# EAGLE design PCB (EAGLE 7.5.0)
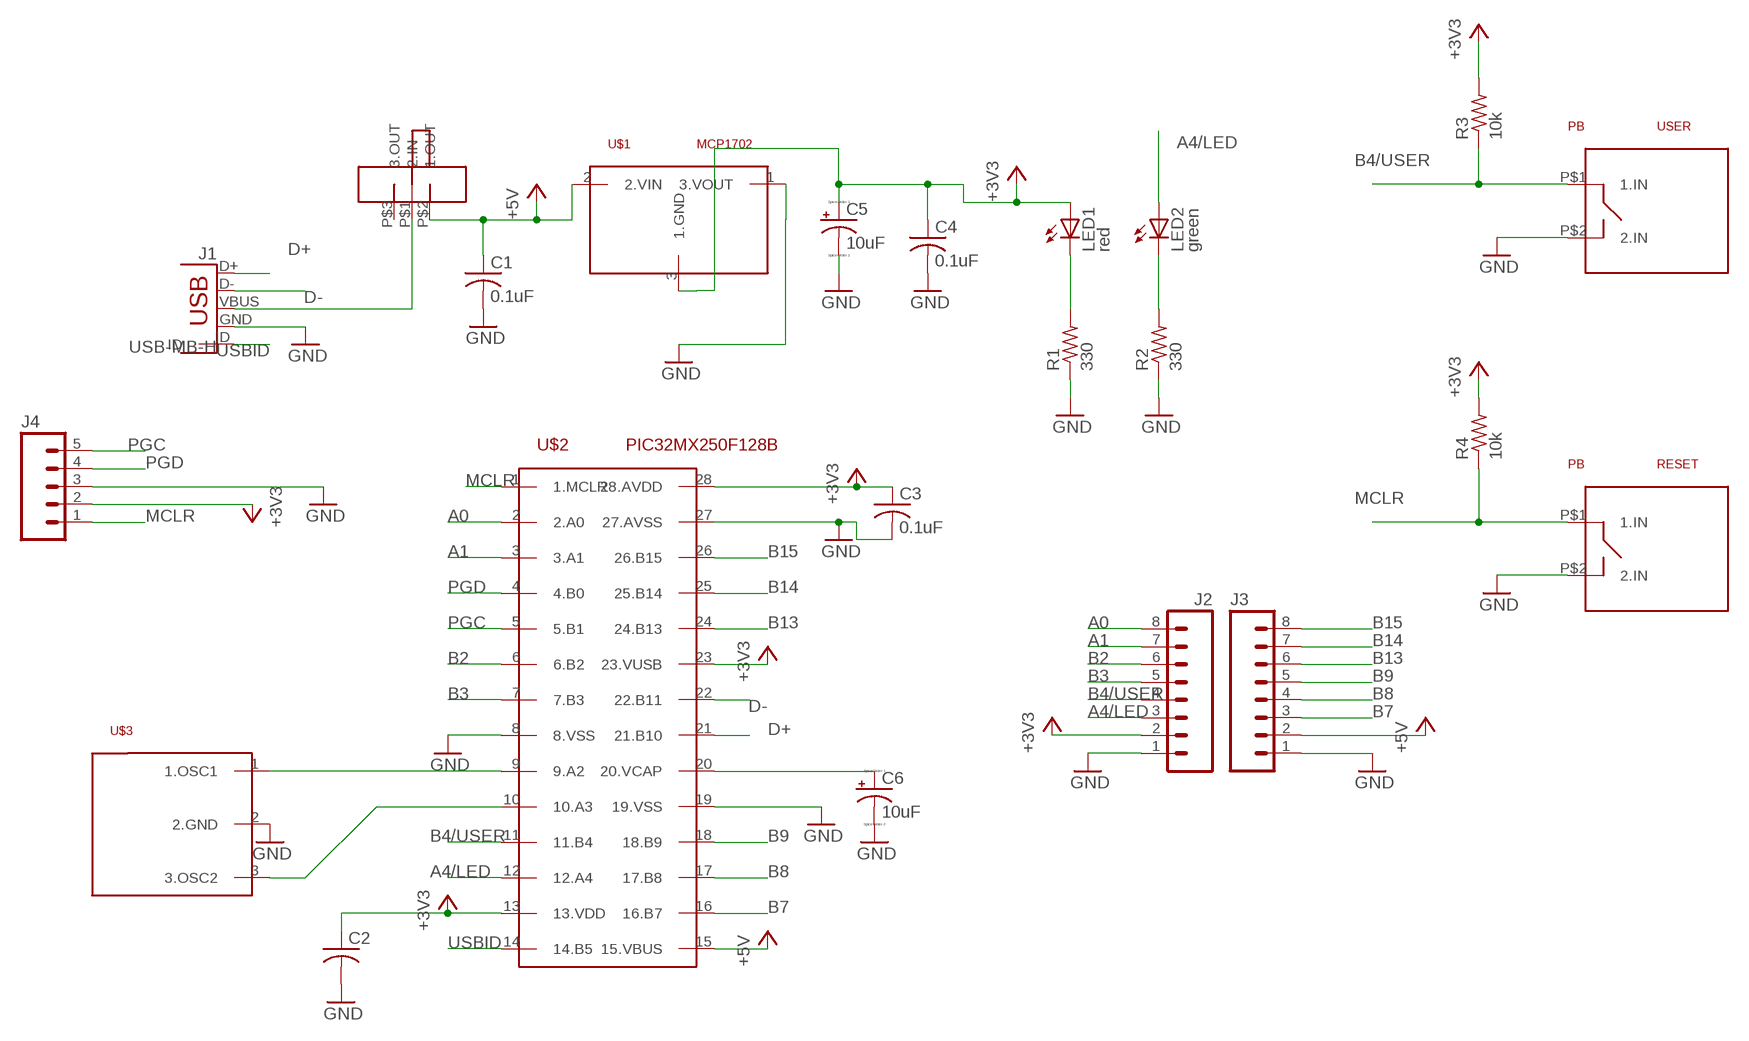
[diagram p0: schematic, sheet 1]

## Parts
C1  0.1uF  C-US025-025X050  [C025-025X050]
C2  C-US025-025X050  [C025-025X050]
C3  0.1uF  C-US025-025X050  [C025-025X050]
C4  0.1uF  C-US025-025X050  [C025-025X050]
C5  10uF  CPOL-USB45181A  [B45181A]
C6  10uF  CPOL-USB45181A  [B45181A]
J1  USB-MB-H  [USB-MB-H]
J2  M08  [1X08_ROUND]
J3  M08  [1X08_ROUND]
J4  M05PTH  [1X05]
LED1  red  LED3MM  [LED3MM]
LED2  green  LED3MM  [LED3MM]
R1  330  R-US_0207/10  [0207/10]
R2  330  R-US_0207/10  [0207/10]
R3  10k  R-US_0207/10  [0207/10]
R4  10k  R-US_0207/10  [0207/10]
RESET  PB  [PUSHBUTTON]
U$1  MCP1702  [TO92]
U$2  PIC32MX250F128B  [DIL28-3]
U$3  CRES  [1X03]
U$5  SLIDE  [SLIDE]
USER  PB  [PUSHBUTTON]

## Nets
+3V3: C2.1 C3.1 C4.1 C5.+ J2.2 J4.2 LED1.A R3.2 R4.2 U$1.3(1.GND) U$2.13(13.VDD) U$2.23(23.VUSB) U$2.28(28.AVDD)
+5V: C1.1 J3.2 U$1.2(2.VIN) U$2.15(15.VBUS) U$5.P$2(1.OUT)
A0: J2.8 U$2.2(2.A0)
A1: J2.7 U$2.3(3.A1)
A4/LED: J2.3 LED2.A U$2.12(12.A4)
B2: J2.6 U$2.6(6.B2)
B3: J2.5 U$2.7(7.B3)
B4/USER: J2.4 R3.1 U$2.11(11.B4) USER.P$1(1.IN)
B7: J3.3 U$2.16(16.B7)
B8: J3.4 U$2.17(17.B8)
B9: J3.5 U$2.18(18.B9)
B13: J3.6 U$2.24(24.B13)
B14: J3.7 U$2.25(25.B14)
B15: J3.8 U$2.26(26.B15)
D+: J1.D+ U$2.21(21.B10)
D-: J1.D- U$2.22(22.B11)
GND: C1.2 C2.2 C3.2 C4.2 C5.- C6.- J1.GND J2.1 J3.1 J4.3 R1.1 R2.1 RESET.P$2(2.IN) U$1.1(3.VOUT) U$2.8(8.VSS) U$2.19(19.VSS) U$2.27(27.AVSS) U$3.2(2.GND) USER.P$2(2.IN)
MCLR: J4.1 R4.1 RESET.P$1(1.IN) U$2.1(1.MCLR)
N$1: J1.VBUS U$5.P$1(2.IN)
N$5: LED2.K(C) R2.2
N$8: LED1.K(C) R1.2
N$29: C6.+ U$2.20(20.VCAP)
N$36: U$2.10(10.A3) U$3.3(3.OSC2)
N$37: U$2.9(9.A2) U$3.1(1.OSC1)
PGC: J4.5 U$2.5(5.B1)
PGD: J4.4 U$2.4(4.B0)
USBID: J1.ID U$2.14(14.B5)
Unconnected: U$5.P$3(3.OUT)

## Library data of the parts
C1-C4 = ME 433 PCB lib:C-US: CAPACITOR, American symbol
C5 C6 = ME 433 PCB lib:CPOL-US: POLARIZED CAPACITOR, American symbol
J1 = ME 433 PCB lib:USB: USB Connectors USB-B-PTH is fully proven SKU : PRT-00139/CONN-08278 USB-miniB is fully proven SKU : PRT-00587 USB-A-PCB is untested. USB-A-H is throughly reviewed, but untested. Spark Fun Electronics SKU : PRT-00437 USB-B-SMT is throughly reviewed, but untested. Needs silkscreen touching up. USB-A-S has not been used/tested USB-MB-H has not been used/tested USB-MICROB has been used. CONN-09505
J2 J3 = ME 433 PCB lib:M08: Header 8 Standard 8-pin 0.1" header. Use with straight break away headers (SKU : PRT-00116), right angle break away headers (PRT-00553), swiss pins (PRT-00743), machine pins (PRT-00117), and female headers (PRT-00115).; PROD_ID: CONN-08437
J4 = ME 433 PCB lib:M05: Header 5 Standard 5-pin 0.1" header. Use with straight break away headers (SKU : PRT-00116), right angle break away headers (PRT-00553), swiss pins (PRT-00743), machine pins (PRT-00117), and female headers (PRT-00115). Molex polarized connector foot print use with SKU : PRT-08230 with associated crimp pins and housings.
LED1 LED2 = ME 433 PCB lib:LED: LED OSRAM: - CHIPLED LG R971, LG N971, LY N971, LG Q971, LY Q971, LO R971, LY R971 LH N974, LH R974 LS Q976, LO Q976, LY Q976 LO Q996 - Hyper CHIPLED LW Q18S LB Q993, LB Q99A, LB R99A - SideLED LS A670, LO A670, LY A670, LG A670, LP A670 LB A673, LV A673, LT A673, LW A673 LH A674 LY A675 LS A676, LA A676, LO A676, LY A676, LW A676 LS A679, LY A679, LG A679 - Hyper Micro SIDELED® LS Y876, LA Y876, LO Y876, LY Y876 LT Y87S - SmartLED LW L88C, LW L88S LB L89C, LB L89S, LG L890 LS L89K, LO L89K, LY L89K LS L896, LA L896, LO L896, LY L896 - TOPLED LS T670, LO T670, LY T670, LG T670, LP T670 LSG T670, LSP T670, LSY T670, LOP T670, LYG T670 LG T671, LOG T671, LSG T671 LB T673, LV T673, LT T673, LW T673 LH T674 LS T676, LA T676, LO T676, LY T676, LB T676, LH T676, LSB T676, LW T676 LB T67C, LV T67C, LT T67C, LS T67K, LO T67K, LY T67K, LW E67C LS E67B, LA E67B, LO E67B, LY E67B, LB E67C, LV E67C, LT E67C LW T67C LS T679, LY T679, LG T679 LS T770, LO T770, LY T770, LG T770, LP T770 LB T773, LV T773, LT T773, LW T773 LH T774 LS E675, LA E675, LY E675, LS T675 LS T776, LA T776, LO T776, LY T776, LB T776 LHGB T686 LT T68C, LB T68C - Hyper Mini TOPLED® LB M676 - Mini TOPLED Santana® LG M470 LS M47K, LO M47K, LY M47K Source: http://www.osram.convergy.de LUXEON: - LUMILED® LXK2-PW12-R00, LXK2-PW12-S00, LXK2-PW14-U00, LXK2-PW14-V00 LXK2-PM12-R00, LXK2-PM12-S00, LXK2-PM14-U00 LXK2-PE12-Q00, LXK2-PE12-R00, LXK2-PE12-S00, LXK2-PE14-T00, LXK2-PE14-U00 LXK2-PB12-K00, LXK2-PB12-L00, LXK2-PB12-M00, LXK2-PB14-N00, LXK2-PB14-P00, LXK2-PB14-Q00 LXK2-PR12-L00, LXK2-PR12-M00, LXK2-PR14-Q00, LXK2-PR14-R00 LXK2-PD12-Q00, LXK2-PD12-R00, LXK2-PD12-S00 LXK2-PH12-R00, LXK2-PH12-S00 LXK2-PL12-P00, LXK2-PL12-Q00, LXK2-PL12-R00 Source: www.luxeon.com KINGBRIGHT: KA-3528ASYC Source: www.kingbright.com
R1-R4 = ME 433 PCB lib:R-US_: RESISTOR, American symbol
RESET USER = ME 433 PCB lib:PB
U$1 = ME 433 PCB lib:MCP1702
U$2 = ME 433 PCB lib:PIC32MX250F128B
U$3 = ME 433 PCB lib:CRES
U$5 = ME 433 PCB lib:SLIDE

## Board
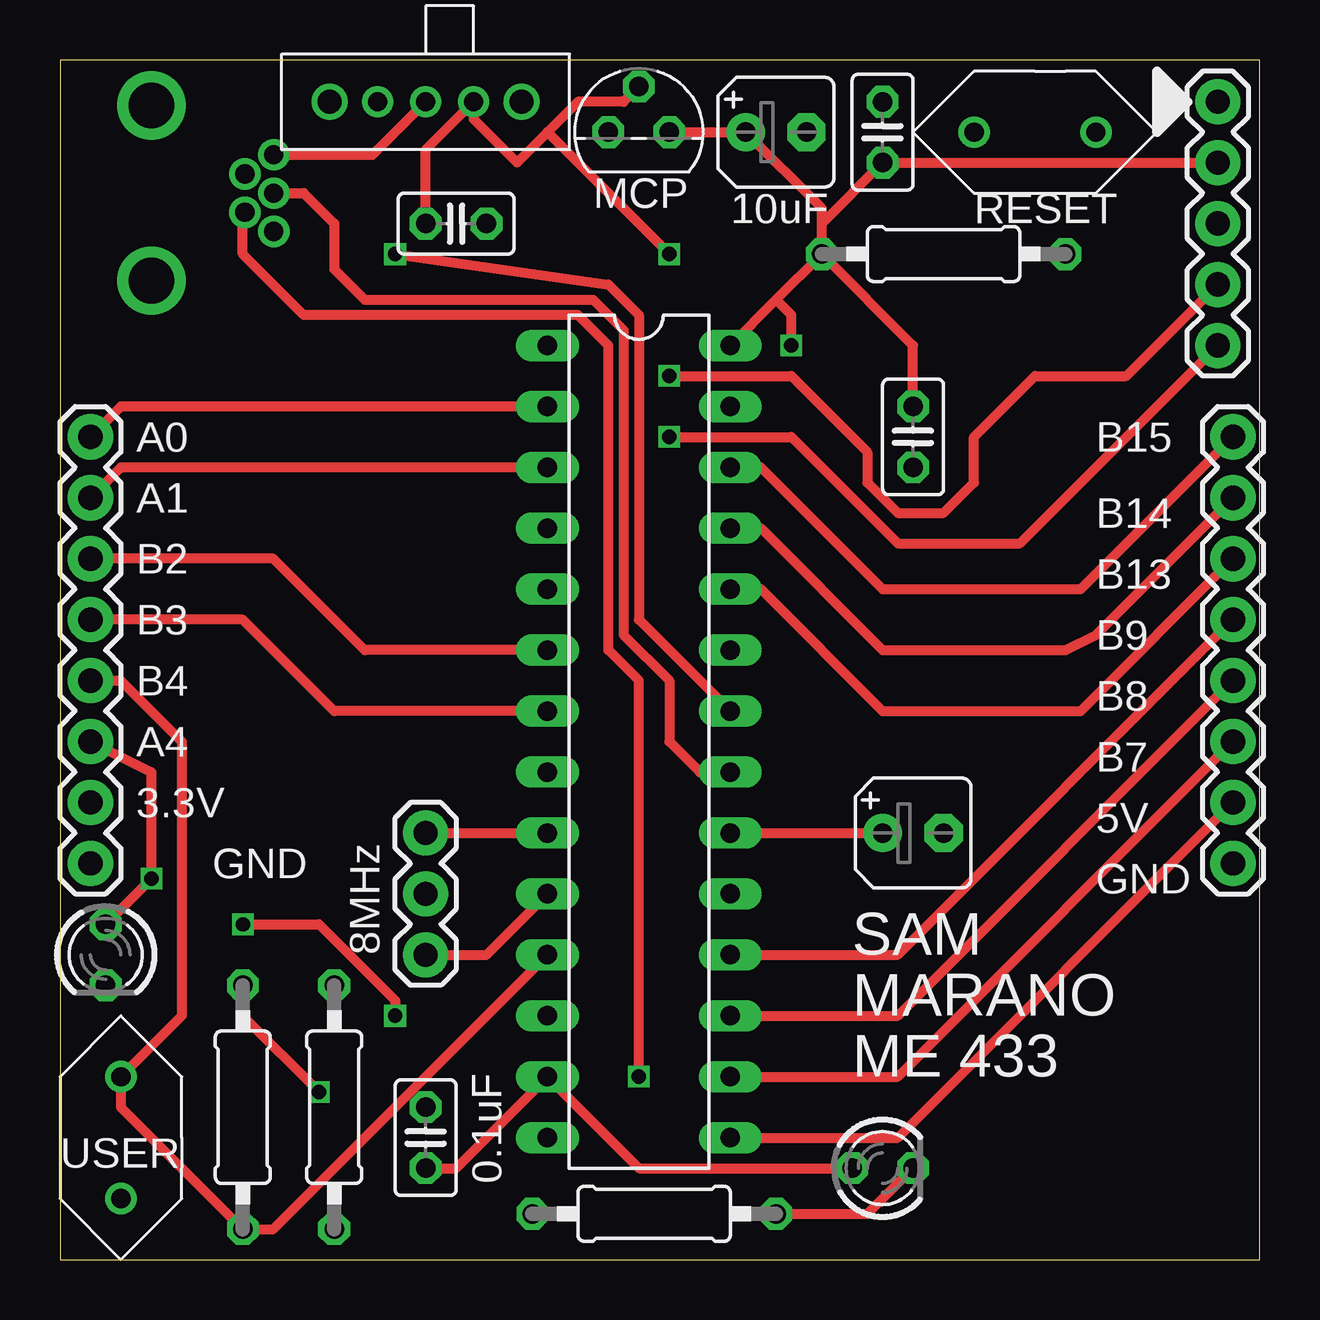
[diagram p1: board, top side]
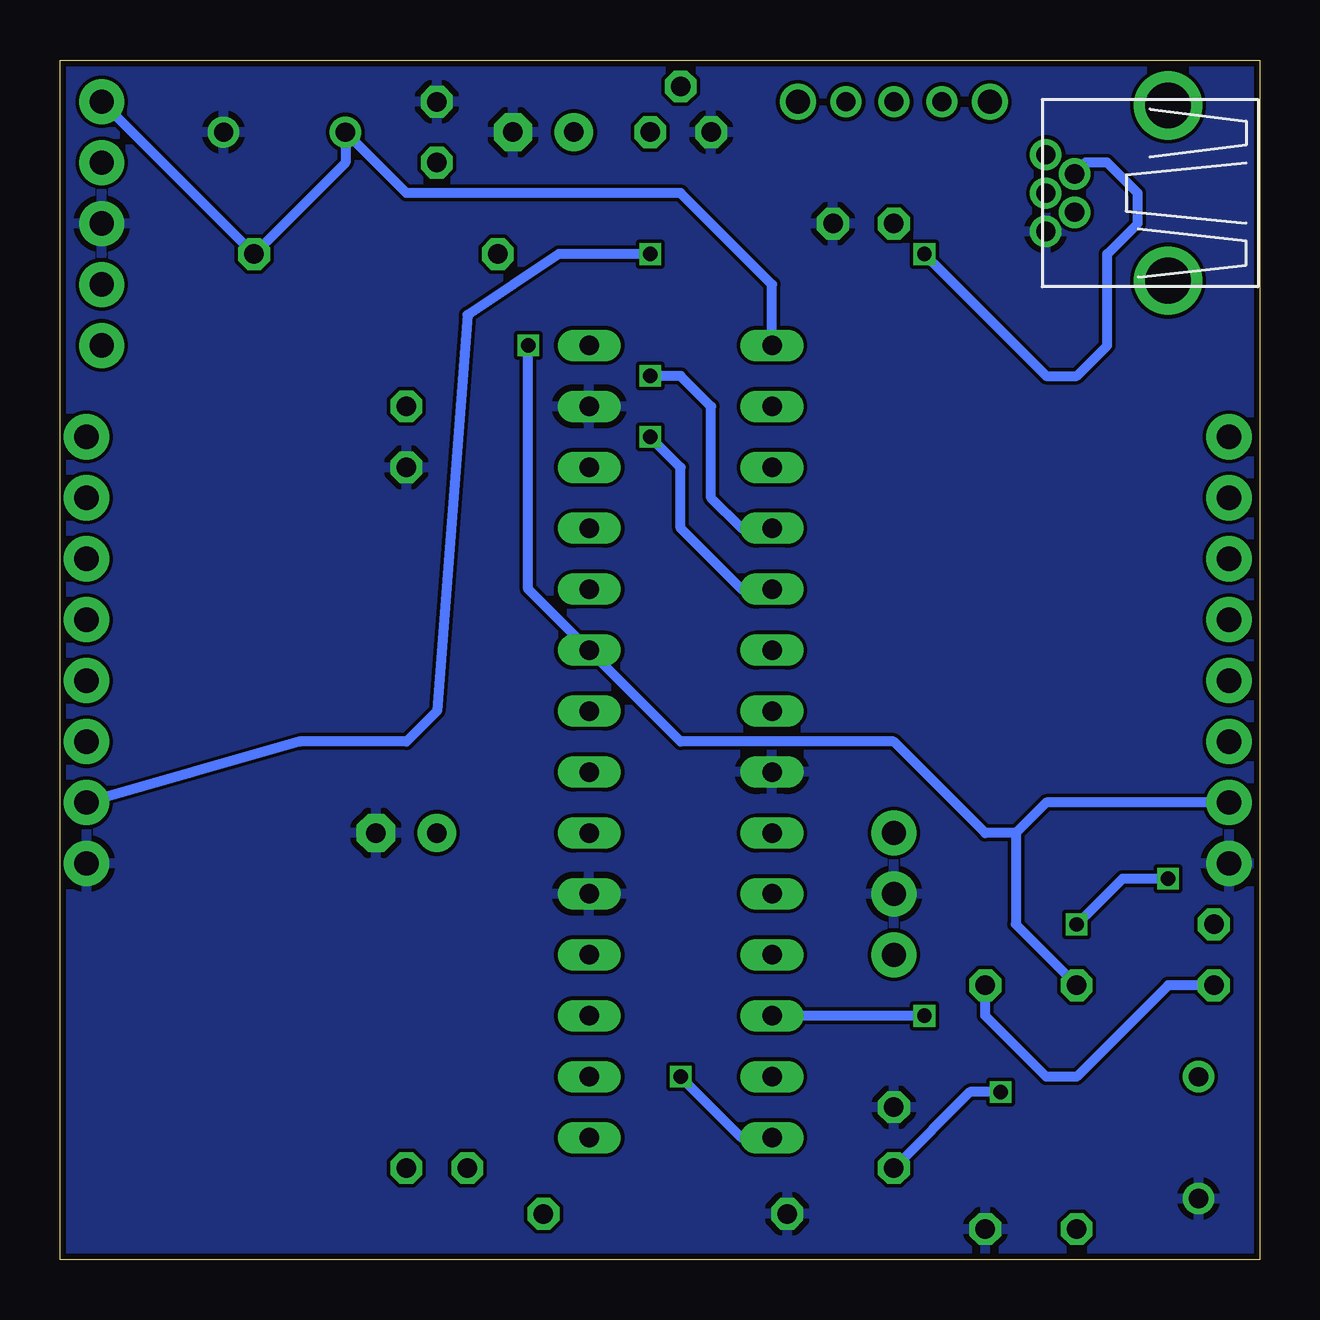
[diagram p2: board, bottom side, seen from below]

Size 50 x 50 mm. Coordinates in mm from the lower left corner, seen from the top.
Outline: 0,0 50,0 50,50 0,50 0,0
Copper layers (1*16): Top 0.035mm / dielectric 1.5mm / Bottom 0.035mm
Design rules "SeeedStudio_2layer_DRU_no_angle_20140221": minimum track width 6mil, minimum drill 12mil, track to track 6mil, track to pad 6mil, pad to pad 6mil, via to via 6mil, smd to smd 0mil, copper to edge 10mil, drill to drill 10mil, minimum pad ring 10mil, minimum via ring 6mil, stop-mask expansion 2mil, vias tented up to drill 100mil, thermal gap 10mil

### Footprints (pad centres in the part's own frame; a part is rotated, then mirrored left to right if it is on the bottom)
C025-025X050 = drill 0.813 octagon: 1 -1.27,0; 2 1.27,0
B45181A = drill 0.813 pad 1.6: + -1.27,0 | drill 0.813 pad 1.6 octagon: - 1.27,0
USB-MB-H = drill 0.8: D+ 5.1,0; D- 3.9,0.8; GND 5.1,-1.6; ID 3.9,-0.8; VBUS 5.1,1.6 | drill 1.9: P$6 0,-3.65; P$7 0,3.65
1X08_ROUND = drill 1.016 pad 1.88: 1 0,0; 2 2.54,0; 3 5.08,0; 4 7.62,0; 5 10.16,0; 6 12.7,0; 7 15.24,0; 8 17.78,0
1X05 = drill 1.016 pad 1.88: 1 0,0; 2 2.54,0; 3 5.08,0; 4 7.62,0; 5 10.16,0
LED3MM = drill 0.813 octagon: A -1.27,0; K 1.27,0
0207/10 = drill 0.813 octagon: 1 -5.08,0; 2 5.08,0
PUSHBUTTON = drill 0.8: P$1 -2.54,0; P$2 2.54,0
TO92 = drill 0.813 octagon: 1 -1.27,0; 2 0,1.905; 3 1.27,0
DIL28-3 = drill 0.813 long: 1 -16.51,-3.81; 2 -13.97,-3.81; 3 -11.43,-3.81; 4 -8.89,-3.81; 5 -6.35,-3.81; 6 -3.81,-3.81; 7 -1.27,-3.81; 8 1.27,-3.81; 9 3.81,-3.81; 10 6.35,-3.81; 11 8.89,-3.81; 12 11.43,-3.81; 13 13.97,-3.81; 14 16.51,-3.81; 15 16.51,3.81; 16 13.97,3.81; 17 11.43,3.81; 18 8.89,3.81; 19 6.35,3.81; 20 3.81,3.81; 21 1.27,3.81; 22 -1.27,3.81; 23 -3.81,3.81; 24 -6.35,3.81; 25 -8.89,3.81; 26 -11.43,3.81; 27 -13.97,3.81; 28 -16.51,3.81
1X03 = drill 1.016 pad 1.88: 1 0,0; 2 2.54,0; 3 5.08,0
SLIDE = drill 0.8: P$1 0,0; P$2 -2,0; P$3 2,0 | drill 1: P$4 -4,0; P$5 4,0

### Placement (x,y rotation side)
C1  16.51,43.18 0 top
C2  15.24,5.08 90 top
C3  35.56,34.29 270 top
C4  34.29,46.99 90 top
C5  29.84,46.99 0 top
C6  35.56,17.78 0 top
J1  3.81,44.45 0 top
J2  1.27,16.51 90 top
J3  48.9,16.51 90 top
J4  48.26,48.26 270 top
LED1  34.29,3.81 0 top
LED2  1.91,12.7 270 top
R1  24.77,1.91 0 top
R2  11.43,6.35 90 top
R3  7.62,6.35 90 top
R4  36.83,41.91 180 top
RESET  40.64,46.99 0 top
U$1  24.13,46.99 0 top
U$2  24.13,21.59 270 top
U$3  15.24,17.78 270 top
U$5  15.24,48.26 180 top
USER  2.54,5.08 270 top

### Tracks (layer width: path | path; a pad name or v marks a point on that pad's centre or on a via)
+3V3  (via drill 0.6)
  Top 0.406: C3.1 35.56,38.1 R4.2 | U$2.28 29.84,40.01 | 29.84,40.01 R4.2 | R4.2 31.75,43.18 | 31.75,43.18 31.75,43.81 C5.+ U$1.3 | 31.75,43.18 C4.1 J4.2 | R3.2 7.62,10.16 v10.79,6.99 | C2.1 16.51,3.81 U$2.13 24.13,3.81 LED1.A | v30.48,38.1 30.48,39.37 29.84,40.01
  Bottom 0.406: J2.2 8.89,19.05 10.16,17.78 | 10.16,17.78 10.16,13.97 R3.2 | v10.79,6.99 12.06,6.99 C2.1 | 10.16,17.78 11.43,17.78 15.24,21.59 24.13,21.59 U$2.23 30.48,27.94 v30.48,38.1
+5V  (via drill 0.6)
  Top 0.406: C1.1 15.24,46.26 U$5.P$2 17.24,47.53 19.05,45.72 20.32,46.99 | U$1.2 23.5,48.26 21.59,48.26 20.32,46.99 | 20.32,46.99 v25.4,41.91 | U$2.15 34.92,5.08 J3.2
  Bottom 0.406: v25.4,41.91 29.21,41.91 33.02,39.37 34.29,22.86 35.56,21.59 40.01,21.59 J3.2
A0
  Top 0.406: U$2.2 2.54,35.56 J2.8
A1
  Top 0.406: U$2.3 2.54,33.02 J2.7
A4/LED  (via drill 0.6)
  Top 0.406: J2.3 3.81,20.32 v3.81,15.88 LED2.A | v7.62,13.97 10.79,13.97 13.97,10.79 v13.97,10.16
  Bottom 0.406: v3.81,15.88 5.71,15.88 v7.62,13.97 | v13.97,10.16 U$2.12
B2
  Top 0.406: U$2.6 12.7,25.4 8.89,29.21 J2.6
B3
  Top 0.406: U$2.7 11.43,22.86 7.62,26.67 J2.5
B4/USER
  Top 0.406: U$2.11 8.89,1.27 R3.1 2.54,6.35 USER.P$1 5.08,10.16 5.08,21.59 2.54,24.13 J2.4
B7
  Top 0.406: U$2.16 34.92,7.62 J3.3
B8
  Top 0.406: U$2.17 34.92,10.16 J3.4
B9
  Top 0.406: U$2.18 34.92,12.7 J3.5
B13
  Top 0.406: U$2.24 29.21,27.94 34.29,22.86 42.55,22.86 J3.6
B14
  Top 0.406: U$2.25 29.21,30.48 34.29,25.4 41.91,25.4 43.18,26.04 J3.7
B15
  Top 0.406: U$2.26 29.21,33.02 34.29,27.94 42.55,27.94 J3.8
D+
  Top 0.406: J1.D+ 10.16,44.45 11.43,43.18 11.43,41.27 12.7,40.01 22.23,40.01 23.5,38.73 23.5,26.04 25.4,24.13 25.4,21.59 26.67,20.32 U$2.21
D-  (via drill 0.6)
  Top 0.406: v13.97,41.91 22.86,40.64 24.13,39.37 24.13,26.67 U$2.22
  Bottom 0.406: v13.97,41.91 8.89,36.83 7.62,36.83 6.35,38.1 6.35,41.91 5.08,43.18 5.08,44.45 6.35,45.72 7.24,45.72 J1.D-
GND
  pour Bottom: 0,49.53 0,0 50.8,0 50.8,50.8 0,50.8
MCLR
  Bottom 0.406: U$2.1 20.32,40.64 24.13,44.45 35.56,44.45 RESET.P$1 38.1,45.72 R4.1 J4.1
N$1
  Top 0.406: J1.VBUS 13.03,46.05 U$5.P$1
N$5
  Bottom 0.406: LED2.K 3.81,11.43 7.62,7.62 8.89,7.62 11.43,10.16 R2.2
N$8
  Top 0.406: R1.2 33.66,1.91 LED1.K
N$29
  Top 0.406: U$2.20 C6.+
N$36
  Top 0.406: U$3.3 17.78,12.7 U$2.10
N$37
  Top 0.406: U$3.1 U$2.9
PGC  (via drill 0.6)
  Top 0.406: v25.4,34.29 30.48,34.29 34.92,29.84 40.01,29.84 J4.5
  Bottom 0.406: U$2.5 21.59,27.94 24.13,30.48 24.13,33.02 v25.4,34.29
PGD  (via drill 0.6)
  Top 0.406: v25.4,36.83 30.48,36.83 33.66,33.66 33.66,32.38 34.92,31.11 36.83,31.11 38.1,32.38 38.1,34.29 40.64,36.83 44.45,36.83 J4.4
  Bottom 0.406: U$2.4 21.59,30.48 22.86,31.75 22.86,35.56 24.13,36.83 v25.4,36.83
USBID  (via drill 0.6)
  Top 0.406: v24.13,7.62 24.13,24.13 22.86,25.4 22.86,38.1 21.59,39.37 10.16,39.37 7.62,41.91 7.62,43.56 J1.ID
  Bottom 0.406: U$2.14 21.59,5.08 v24.13,7.62

### Text on the board
tNames: MCP | 10uF | RESET | A0 | B15 | A1 | B14 | B2 | B13 | B3 | B9 | B4 | B8 | A4 | B7 | 3.3V | 5V | GND | GND | 8MHz | SAM | MARANO | ME 433 | USER | 0.1uF